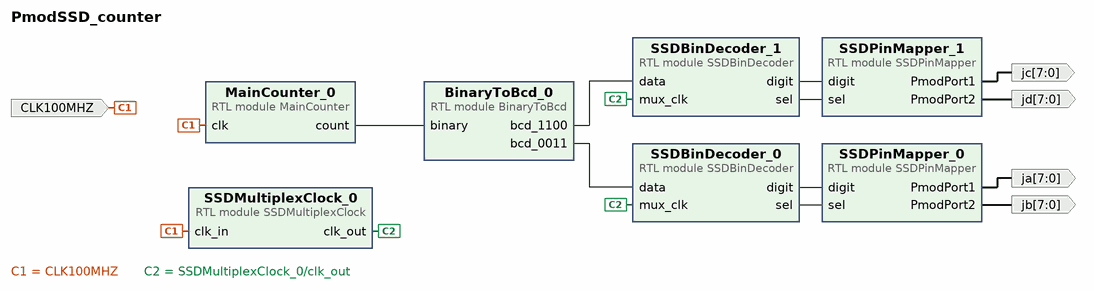
[diagram p0: block diagram of the top level]
# Vivado block design PmodSSD_counter, xc7a100tcsg324-1, Vivado 2023.2
create_bd_design PmodSSD_counter

create_bd_port -dir I CLK100MHZ
create_bd_port -dir O -from 7 -to 0 ja
create_bd_port -dir O -from 7 -to 0 jb
create_bd_port -dir O -from 7 -to 0 jc
create_bd_port -dir O -from 7 -to 0 jd

create_bd_cell -type module -reference MainCounter MainCounter_0
create_bd_cell -type module -reference SSDMultiplexClock SSDMultiplexClock_0
create_bd_cell -type module -reference SSDPinMapper SSDPinMapper_1
create_bd_cell -type module -reference SSDBinDecoder SSDBinDecoder_0
create_bd_cell -type module -reference SSDBinDecoder SSDBinDecoder_1
create_bd_cell -type module -reference SSDPinMapper SSDPinMapper_0
create_bd_cell -type module -reference BinaryToBcd BinaryToBcd_0

# ---- connections ----

connect_bd_net [get_bd_pins BinaryToBcd_0/bcd_0011] [get_bd_pins SSDBinDecoder_0/data]
connect_bd_net [get_bd_pins BinaryToBcd_0/bcd_1100] [get_bd_pins SSDBinDecoder_1/data]
connect_bd_net -net GCLK100_1 [get_bd_ports CLK100MHZ] [get_bd_pins SSDMultiplexClock_0/clk_in] [get_bd_pins MainCounter_0/clk]
connect_bd_net [get_bd_pins MainCounter_0/count] [get_bd_pins BinaryToBcd_0/binary]
connect_bd_net -net SSDBinDecoder_0_segments [get_bd_pins SSDBinDecoder_0/digit] [get_bd_pins SSDPinMapper_0/digit]
connect_bd_net [get_bd_pins SSDBinDecoder_0/sel] [get_bd_pins SSDPinMapper_0/sel]
connect_bd_net -net SSDBinDecoder_1_segments [get_bd_pins SSDBinDecoder_1/digit] [get_bd_pins SSDPinMapper_1/digit]
connect_bd_net [get_bd_pins SSDBinDecoder_1/sel] [get_bd_pins SSDPinMapper_1/sel]
connect_bd_net [get_bd_pins SSDMultiplexClock_0/clk_out] [get_bd_pins SSDBinDecoder_0/mux_clk] [get_bd_pins SSDBinDecoder_1/mux_clk]
connect_bd_net [get_bd_pins SSDPinMapper_0/PmodPort1] [get_bd_ports ja]
connect_bd_net [get_bd_pins SSDPinMapper_0/PmodPort2] [get_bd_ports jb]
connect_bd_net [get_bd_pins SSDPinMapper_1/PmodPort1] [get_bd_ports jc]
connect_bd_net [get_bd_pins SSDPinMapper_1/PmodPort2] [get_bd_ports jd]

validate_bd_design
save_bd_design
